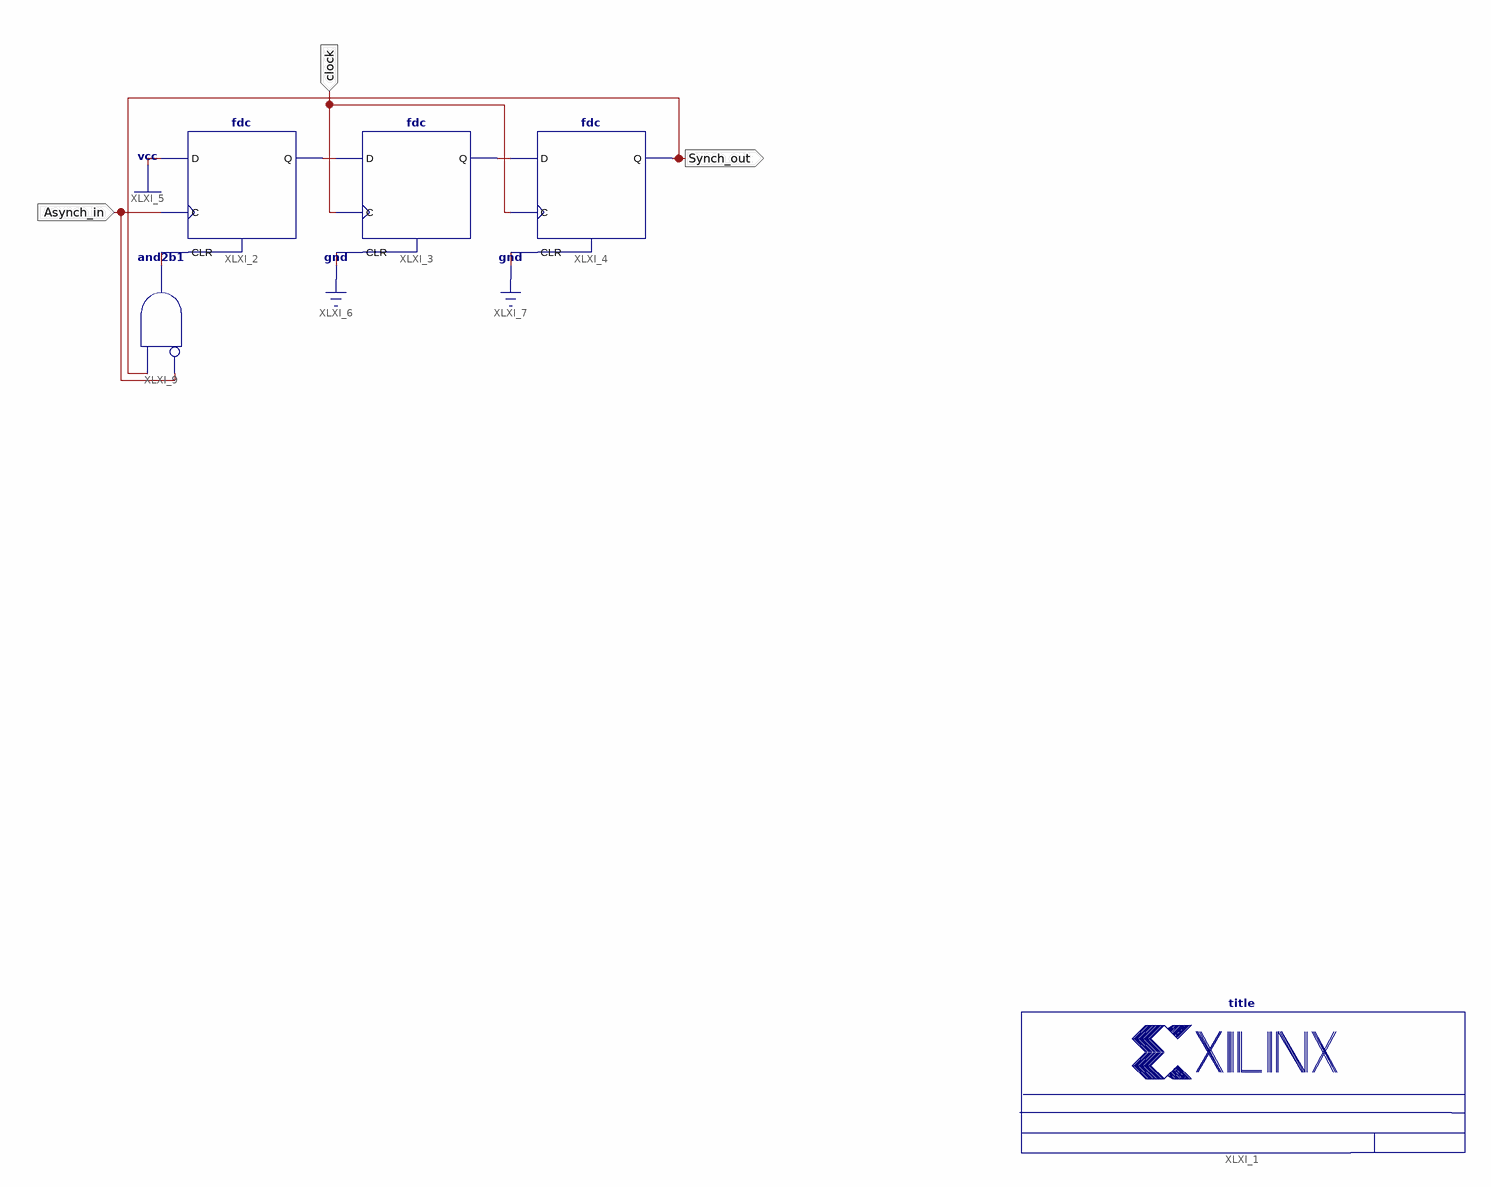
[diagram p0: schematic sheet 1]
// Xilinx ISE schematic fig_5_38b.sch (spartan3e) as structural Verilog: 5 symbols, 3 ports
module fig_5_38b (
  input  clock,
  input  Asynch_in,
  output Synch_out
);

  wire XLXN_1, XLXN_2, XLXN_8;

  title #(.TitleFieldText("Synchronizer when async input less clock period"), .NameFieldText("Figure 5.38 B")) XLXI_1 ();
  fdc XLXI_2 (.C(Asynch_in), .CLR(XLXN_8), .D(1'b1), .Q(XLXN_1));
  fdc XLXI_3 (.C(clock), .CLR(1'b0), .D(XLXN_1), .Q(XLXN_2));
  fdc XLXI_4 (.C(clock), .CLR(1'b0), .D(XLXN_2), .Q(Synch_out));
  and XLXI_9 (XLXN_8, ~Asynch_in, Synch_out);  // and2b1
endmodule
